# EAGLE design H2 REV1.3 (EAGLE 9.6.2)
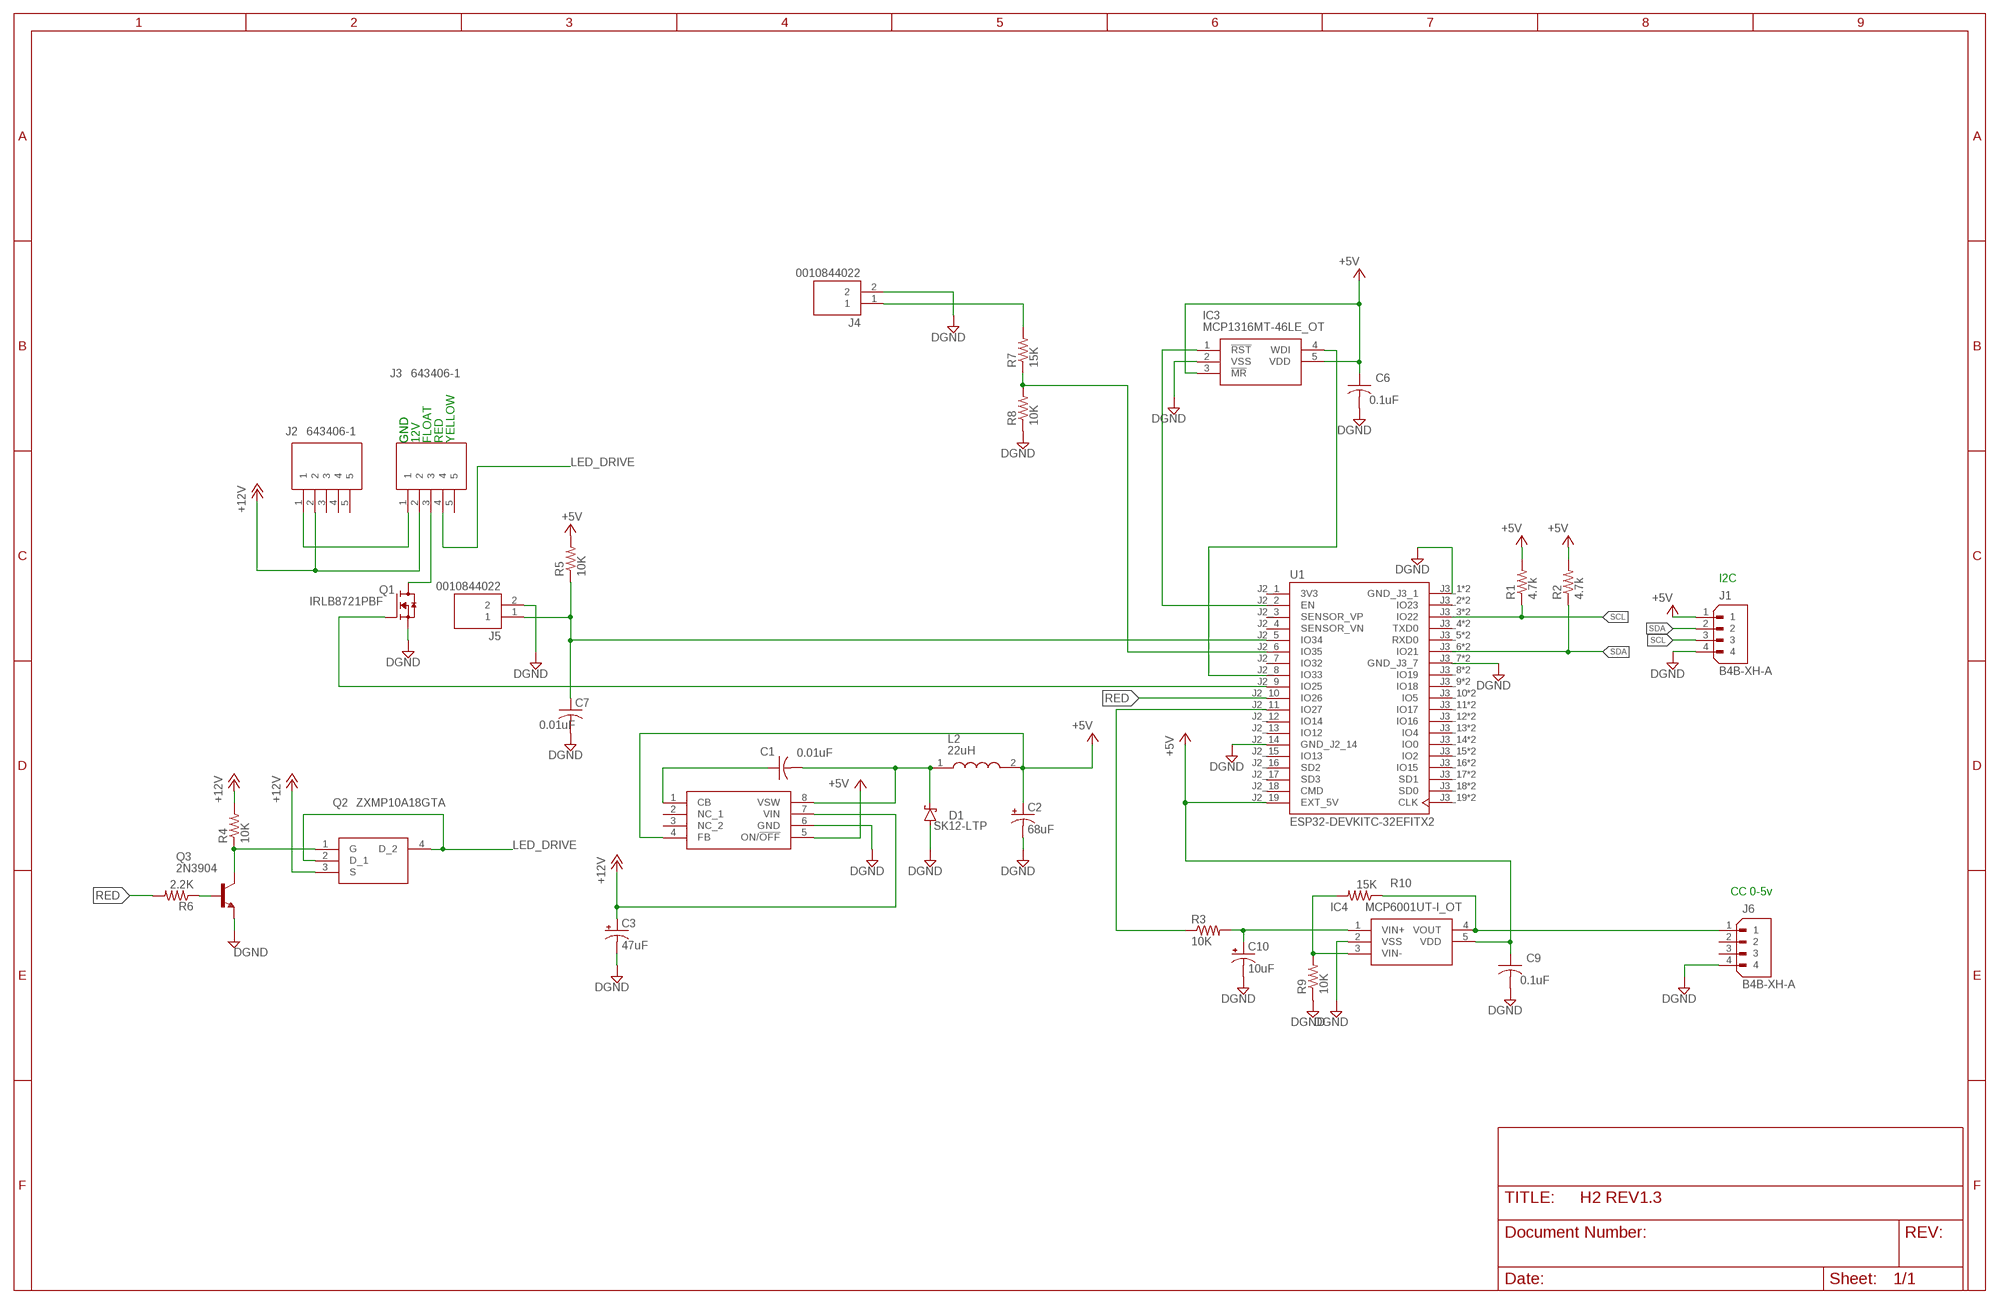
[diagram p0: schematic, sheet 1]

## Parts
C1  0.01uF  C-USC0805  [C0805]
C2  68uF  CPOL-USCT3528  [CT3528]
C3  47uF  CPOL-USCT7343  [CT7343]
C6  0.1uF  C-USC0805  [C0805]
C7  0.01uF  C-USC0805  [C0805]
C9  0.1uF  C-USC0805  [C0805]
C10  10uF  CPOL-USCT7343  [CT7343]
D1  SK12-LTP  SCHOTTKY-DIODESMD  [SMB]
IC2  LM2675M-5.0  LM2675M-ADJ_NOPB  [SOIC127P600X175-8N]
IC3  MCP1316MT-46LE_OT  [SOT95P280X145-5N]
IC4  MCP6001UT-I_OT  [SOT95P280X145-5N]
J1  B4B-XH-A  [JST_B4B-XH-A]
J2  643406-1  [6434061]
J3  643406-1  [6434061]
J4  0010844022  [MOLEX_0010844022]
J5  0010844022  [MOLEX_0010844022]
J6  B4B-XH-A  [JST_B4B-XH-A]
L2  22uH  7447713680  [7447714220]
Q1  IRLB8721PBF  [TO254P1067X483X2057-3]
Q2  ZXMP10A18GTA  [SOT230P700X180-4N]
Q3  2N3904  -NPN-SOT23-EBC  [SOT23-EBC]
R1  4.7k  R-US_R0805  [R0805]
R2  4.7k  R-US_R0805  [R0805]
R3  10K  R-US_R0805  [R0805]
R4  10K  R-US_M0805  [M0805]
R5  10K  R-US_R0805  [R0805]
R6  2.2K  R-US_M0805  [M0805]
R7  15K  R-US_R0805  [R0805]
R8  10K  R-US_R0805  [R0805]
R9  10K  R-US_R0805  [R0805]
R10  15K  R-US_R0805  [R0805]
U1  ESP32-DEVKITC-32EFITX2  [MODULE_ESP32-DEVKITC-32E]

## Nets
+5V: C2.+ C6.1 C9.1 IC2.4(FB) IC2.5(ON/!OFF) IC3.3(!MR) IC3.5(VDD) IC4.5(VDD) J1.1 L2.2 R1.2 R2.2 R5.2 U1.J2_19(EXT_5V)
+12V: C3.+ IC2.7(VIN) J2.2 J3.2 Q2.3(S) R4.2
DGND: C2.- C3.- C6.2 C7.2 C9.2 C10.- D1.A IC2.6(GND) IC3.2(VSS) IC4.2(VSS) J1.4 J4.2 J5.2 J6.4 Q1.3(S) Q3.E R8.1 R9.1 U1.J2_14(GND_J2_14) U1.J3_1(GND_J3_1) U1.J3_7(GND_J3_7) U1.P$1(GND_J3_1) U1.P$7(GND_J3_7)
LED_DRIVE: J3.4 Q2.2(D_1) Q2.4(D_2)
N$1: IC4.4(VOUT) J6.1 R10.1
N$3: Q1.1(G) U1.J2_9(IO25)
N$4: J3.3 Q1.2(D)
N$5: C10.+ IC4.1(VIN+) R3.2
N$6: J4.1 R7.2
N$7: C1.1 IC2.1(CB)
N$8: J2.1 J3.1
N$9: C1.2 D1.C IC2.8(VSW) L2.1
N$11: R7.1 R8.2 U1.J2_6(IO35)
N$12: IC3.1(!RST) U1.J2_2(EN)
N$13: R3.1 U1.J2_11(IO27)
N$14: Q3.B R6.1
N$15: Q2.1(G) Q3.C R4.1
N$16: C7.1 J5.1 R5.1 U1.J2_5(IO34)
N$17: IC3.4(WDI) U1.J2_8(IO33)
N$18: IC4.3(VIN-) R9.2 R10.2
RED: R6.2 U1.J2_10(IO26)
SCL: J1.3 R1.1 U1.J3_3(IO22) U1.P$3(IO22)
SDA: J1.2 R2.1 U1.J3_6(IO21) U1.P$6(IO21)
Unconnected: IC2.2(NC_1) IC2.3(NC_2) J2.3 J2.4 J2.5 J3.5 J6.2 J6.3 U1.J2_3(SENSOR_VP) U1.J2_4(SENSOR_VN) U1.J2_7(IO32) U1.J2_12(IO14) U1.J2_13(IO12) U1.J2_15(IO13) U1.J2_16(SD2) U1.J2_17(SD3) U1.J2_18(CMD) U1.J3_2(IO23) U1.J3_4(TXD0) U1.J3_5(RXD0) U1.J3_8(IO19) U1.J3_9(IO18) U1.J3_10(IO5) U1.J3_11(IO17) U1.J3_12(IO16) U1.J3_13(IO4) U1.J3_14(IO0) U1.J3_15(IO2) U1.J3_16(IO15) U1.J3_17(SD1) U1.J3_18(SD0) U1.J3_19(CLK) U1.P$2(IO23) U1.P$4(TXD0) U1.P$5(RXD0) U1.P$8(IO19) U1.P$9(IO18) U1.P$10(IO5) U1.P$11(IO17) U1.P$12(IO16) U1.P$13(IO4) U1.P$14(IO0) U1.P$15(IO2) U1.P$16(IO15) U1.P$17(SD1) U1.P$18(SD0) U1.P$19(CLK)

## Notes on the sheet
- GND | GND | 12V | FLOAT | RED | YELLOW
- I2C
- CC 0-5v

## Power pins joined to a net without a drawn wire
3V3: U1.J2_1(3V3)

## Library data of the parts
C1 C6 C7 C9 = rcl:C-US: CAPACITOR, American symbol; SPICEPREFIX: C
C2 C3 C10 = rcl:CPOL-US: POLARIZED CAPACITOR, American symbol; SPICEPREFIX: C
D1 = diode:SCHOTTKY-DIODE: Schottky Diode
IC2 = LM2675M-ADJ_NOPB:LM2675M-ADJ_NOPB: SIMPLE SWITCHER 6.5V to 40V, 1A Low Component Count Step-Down Regulator Source: Datasheet <https://datasheet.datasheetarchive.com/originals/distributors/Datasheets-SFU2/DSASFU100036609.pdf>; DESCRIPTION: SIMPLE SWITCHER 6.5V to 40V, 1A Low Component Count Step-Down Regulator; HEIGHT: 1.75mm; MANUFACTURER_NAME: Texas Instruments; MANUFACTURER_PART_NUMBER: LM2675M-ADJ/NOPB; MOUSER_PART_NUMBER: 926-LM2675M-ADJ/NOPB; MOUSER_PRICE-STOCK: https://www.mouser.co.uk/ProductDetail/Texas-Instruments/LM2675M-ADJ-NOPB?qs=X1J7HmVL2ZGqnEBT23BgrQ%3D%3D
IC3 = MCP1316MT-46LE_OT:MCP1316MT-46LE_OT: Low Supply Current: 1 A (Typical),10 A (Max.) Precision Monitoring Trip Point Options: - 2.9V and 4.6V (Standard Offerings) - 2.0V to 4.7V in 100 mV Increments, (Contact the local Microchip Sales Office) Resets Microcontroller in a Power-loss Event Reset Delay Time-Out Option: - 1.4 ms, 30 ms, 200 ms, or 1.6s (Typical) Watchdog Timer Input Time-Out Options: - 6.3 ms, 102 ms, 1.6s, or 25.6s (Typical) Manual Reset (MR) Input (Active-low) Single and Complementary Reset Output(s) R Source: Datasheet <http://www.microchip.com/mymicrochip/filehandler.aspx?ddocname=en025429>; DESCRIPTION: Low Supply Current: 1 A (Typical),10 A (Max.) Precision Monitoring Trip Point Options: - 2.9V and 4.6V (Standard Offerings) - 2.0V to 4.7V in 100 mV Increments, (Contact the local Microchip Sales Office) Resets Microcontroller in a Power-loss Event Reset Delay Time-Out Option: - 1.4 ms, 30 ms, 200 ms, or 1.6s (Typical) Watchdog Timer Input Time-Out Options: - 6.3 ms, 102 ms, 1.6s, or 25.6s (Typical) Manual Reset (MR) Input (Active-low) Single and Complementary Reset Output(s) R; HEIGHT: 1.45mm; MANUFACTURER_NAME: Microchip; MANUFACTURER_PART_NUMBER: MCP1316MT-46LE/OT; MOUSER_PART_NUMBER: 579-MCP1316MT46LE/OT; MOUSER_PRICE-STOCK: https://www.mouser.co.uk/ProductDetail/Microchip-Technology/MCP1316MT-46LE-OT/?qs=usxtMOJb1RwRwhJF9sjOIg%3D%3D
IC4 = MCP6001UT-I_OT:MCP6001UT-I_OT: 1 MHz, Low-Power Op Amp Source: Datasheet <http://componentsearchengine.com/Datasheets/3/MCP6001UT-I_OT.pdf>; DESCRIPTION: 1 MHz, Low-Power Op Amp; HEIGHT: 1.45mm; MANUFACTURER_NAME: Microchip; MANUFACTURER_PART_NUMBER: MCP6001UT-I/OT; MOUSER_PART_NUMBER: 579-MCP6001UT-I/OT; MOUSER_PRICE-STOCK: https://www.mouser.co.uk/ProductDetail/Microchip-Technology/MCP6001UT-I-OT?qs=Sez7gRs8XSU2iw24kVuIOw%3D%3D
J1 J6 = B4B-XH-A:B4B-XH-A: Check availability <https://pricing.snapeda.com/parts/B4B-XH-A/JST%20Sales/view-part?ref=eda>; AVAILABILITY: In Stock; CHECK_PRICES: https://www.snapeda.com/parts/B4B-XH-A/JST/view-part/?ref=eda; DESCRIPTION: Connector Header Through Hole 4 position 0.098 (2.50mm); MF: JST Sales; MP: B4B-XH-A; PACKAGE: None; PRICE: None; SNAPEDA_LINK: https://www.snapeda.com/parts/B4B-XH-A/JST/view-part/?ref=snap
J2 J3 = 643406-1:643406-1: Configuration Features: Number of Positions 5 | Number of Rows 1 | PCB Mount Orientation Vertical | Number of Power Positions 5 | Contact Features: Contact Mating Area Plating Material Thickness 3.81 5.08 MICM | Contact Layout Inline | Contact Retention Within Housing Without | Contact Mating Area Plating Material Thickness 150 200 MICIN | Contact Current Rating (Max) 12 AMP | Contact Type Pin | Contact Mating Area Plating Material Tin | PCB Contact Termination Area Plating Material Pre-Tin | Multip Source: Datasheet <https://www.te.com/commerce/DocumentDelivery/DDEController?Action=srchrtrv&DocNm=82181_SOFTSHELL_STANDARD_DENSITY&DocType=Catalog Section&DocLang=English&PartCntxt=643406-1&DocFormat=pdf>; DESCRIPTION: Configuration Features: Number of Positions 5 | Number of Rows 1 | PCB Mount Orientation Vertical | Number of Power Positions 5 | Contact Features: Contact Mating Area Plating Material Thickness 3.81 5.08 MICM | Contact Layout Inline | Contact Retention Within Housing Without | Contact Mating Area Plating Material Thickness 150 200 MICIN | Contact Current Rating (Max) 12 AMP | Contact Type Pin | Contact Mating Area Plating Material Tin | PCB Contact Termination Area Plating Material Pre-Tin | Multip; HEIGHT: 14.86mm; MANUFACTURER_NAME: TE Connectivity; MANUFACTURER_PART_NUMBER: 643406-1; MOUSER_PART_NUMBER: 571-6434061; MOUSER_PRICE-STOCK: https://www.mouser.co.uk/ProductDetail/TE-Connectivity-AMP/643406-1?qs=WZe4RBw4ZxdOz8s%252B2HqyCA%3D%3D
J4 J5 = 0010844022:0010844022; MANUFACTURER: Molex; MAXIMUM_PACKAGE_HEIGHT: 13.97mm; PARTREV: D6; STANDARD: Manufacturer Recommendations
L2 = 7447713680:7447713680: SMD-Shielded Power Inductors WE-PD Source: Datasheet <https://componentsearchengine.com/Datasheets/1/7447713680.pdf>; DESCRIPTION: SMD-Shielded Power Inductors WE-PD; HEIGHT: 5mm; MANUFACTURER_NAME: Wurth Elektronik; MANUFACTURER_PART_NUMBER: 7447713680; MOUSER_PART_NUMBER: 710-7447713680; MOUSER_PRICE-STOCK: https://www.mouser.com/Search/Refine.aspx?Keyword=710-7447713680
Q1 = IRLB8721PBF:IRLB8721PBF: Check availability <https://pricing.snapeda.com/parts/IRLB8721PBF/Infineon%20Technologies/view-part?ref=eda>; AVAILABILITY: In Stock; CHECK_PRICES: https://www.snapeda.com/parts/IRLB8721PBF/Infineon/view-part/?ref=eda; DESCRIPTION: IRLB8721PBF N-channel MOSFET Transistor, 62 A, 30 V, 3-Pin TO-220AB | Infineon IRLB8721PBF; MF: Infineon Technologies; MP: IRLB8721PBF; PACKAGE: TO-220-3 Infineon; PRICE: None; SNAPEDA_LINK: https://www.snapeda.com/parts/IRLB8721PBF/Infineon/view-part/?ref=snap
Q2 = ZXMP10A18GTA:ZXMP10A18GTA: MOSFET P-Channel 100V 3.7A SOT223 Diodes Inc ZXMP10A18GTA P-channel MOSFET Transistor, 3.7 A, 100 V, 3+Tab-Pin SOT-223 Source: Datasheet <https://www.diodes.com//assets/Datasheets/ZXMP10A18G.pdf>; DESCRIPTION: MOSFET P-Channel 100V 3.7A SOT223 Diodes Inc ZXMP10A18GTA P-channel MOSFET Transistor, 3.7 A, 100 V, 3+Tab-Pin SOT-223; HEIGHT: 1.8mm; MANUFACTURER_NAME: Diodes Incorporated; MANUFACTURER_PART_NUMBER: ZXMP10A18GTA; MOUSER_PART_NUMBER: 522-ZXMP10A18GTA; MOUSER_PRICE-STOCK: https://www.mouser.co.uk/ProductDetail/Diodes-Incorporated/ZXMP10A18GTA?qs=4zh0VFflF2HAv%2FEizliMow%3D%3D
Q3 = transistor:*-NPN-: NPN Transistror BF959 corrected 2008.03.06
R1-R10 = rcl:R-US_: RESISTOR, American symbol; SPICEPREFIX: R
U1 = ESP32-DEVKITC-32E:ESP32-DEVKITC-32E: Check availability <https://pricing.snapeda.com/parts/ESP32-DEVKITC-32E/Espressif%20Systems/view-part?ref=eda>

## Board
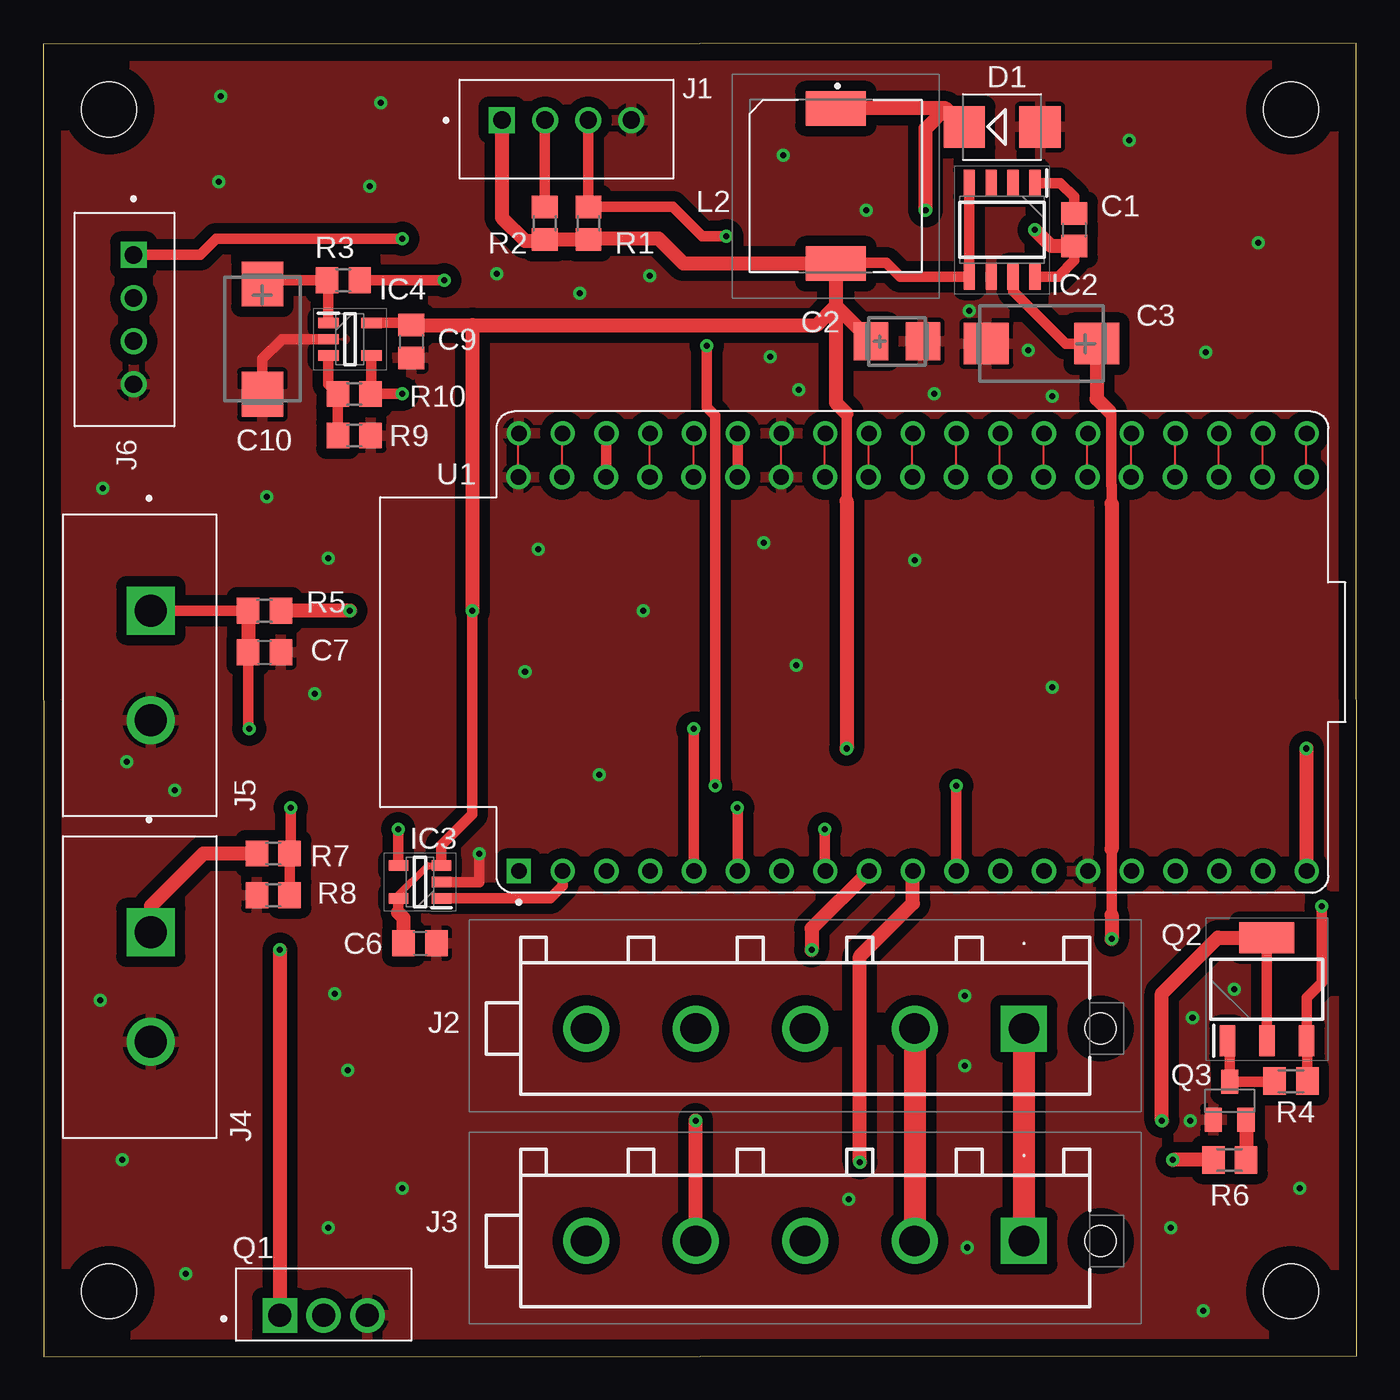
[diagram p1: board, top side]
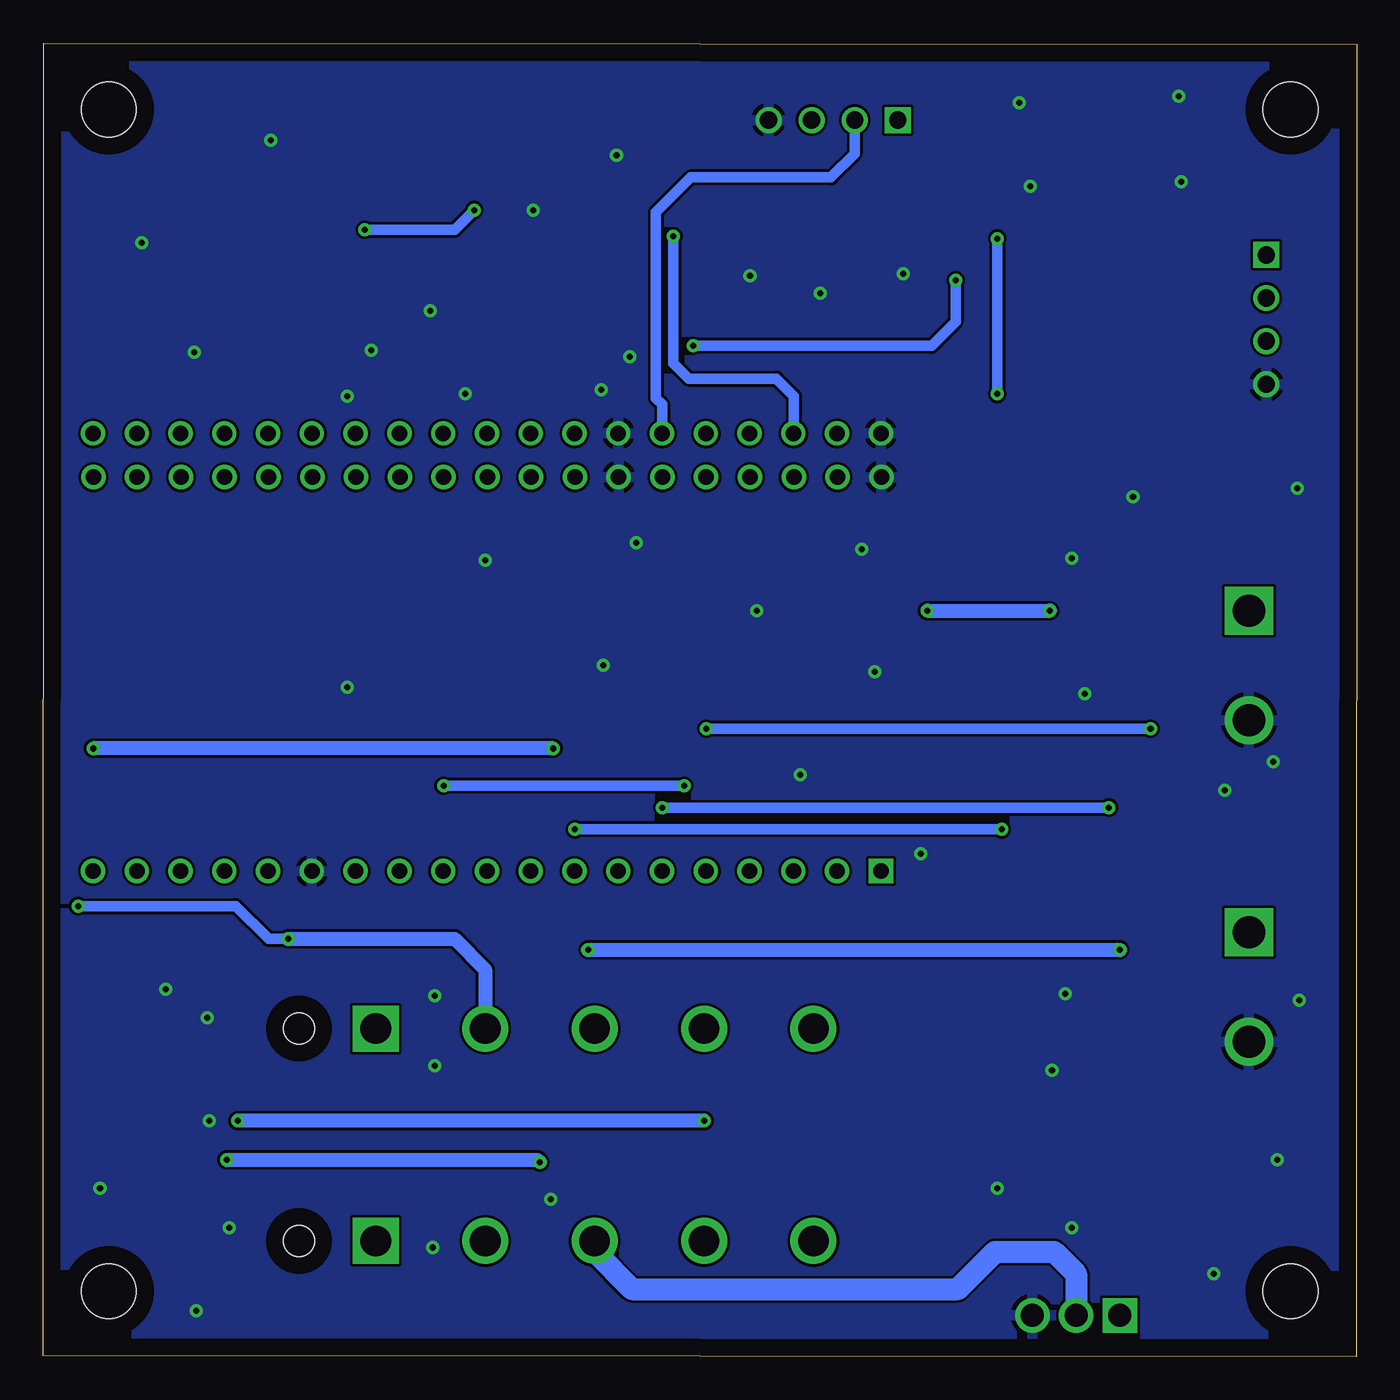
[diagram p2: board, bottom side, seen from below]

Size 76.23 x 76.24 mm. Coordinates in mm from the lower left corner, seen from the top.
Outline: 0.03,0 76.23,0.08 76.2,76.24 0,76.17 0.03,0
Copper layers (1*16): Top 0.035mm / dielectric 1.5mm / Bottom 0.035mm
Design rules "default": minimum track width 6mil, minimum drill 0.35mm, track to track 6mil, track to pad 6mil, pad to pad 6mil, via to via 6mil, smd to smd 6mil, copper to edge 40mil, drill to drill 6mil, minimum pad ring 10mil, minimum via ring 8mil, stop-mask expansion 4mil, vias tented up to drill 0mil, thermal gap 10mil
Holes 3.17 mm at 3.84,3.81 72.42,3.81 72.42,72.39 3.84,72.39

### Footprints (pad centres in the part's own frame; a part is rotated, then mirrored left to right if it is on the bottom)
C0805 = smd 1.3 x 1.5: 1 -0.95,0; 2 0.95,0
CT3528 = smd 2 x 2.2: + -1.5,0; - 1.5,0
CT7343 = smd 2.6 x 2.4: + -3.2,0; - 3.2,0
SMB = smd 2.4 x 2.4: A 2.2,0; C -2.2,0
SOIC127P600X175-8N = smd 1.528 x 0.65: 1 -2.711,1.905; 2 -2.711,0.635; 3 -2.711,-0.635; 4 -2.711,-1.905; 5 2.711,-1.905; 6 2.711,-0.635; 7 2.711,0.635; 8 2.711,1.905
SOT95P280X145-5N = smd 1.15 x 0.6: 1 -1.25,0.95; 2 -1.25,0; 3 -1.25,-0.95; 4 1.25,-0.95; 5 1.25,0.95
SOT95P280X145-5N' = smd 1.2 x 0.6: 1 -1.25,0.95; 2 -1.25,0; 3 -1.25,-0.95; 4 1.25,-0.95; 5 1.25,0.95
JST_B4B-XH-A = drill 1 square: 1 3.75,-0.525 | drill 1: 2 1.25,-0.525; 3 -1.25,-0.525; 4 -3.75,-0.525
6434061 = drill 1.78 pad 2.67 square: 1 0,0 | drill 1.78 pad 2.67: 2 6.35,0; 3 12.7,0; 4 19.05,0; 5 25.4,0 | hole 1.78: -4.45,0
MOLEX_0010844022 = drill 1.86 square: 1 -3.175,0 | drill 1.86: 2 3.175,0
7447714220 = smd 2 x 3.5: 1 -4.5,0; 2 4.5,0
TO254P1067X483X2057-3 = drill 1.33 pad 2 square: 1 -2.54,0 | drill 1.33 pad 2: 2 0,0; 3 2.54,0
SOT230P700X180-4N = smd 1.8 x 0.9: 1 -3,2.3; 2 -3,0; 3 -3,-2.3 | smd 1.8 x 3.2: 4 3,0
SOT23-EBC = smd 1 x 1.4: B 0.95,-1.1; C 0,1.1; E -0.95,-1.1
R0805 = smd 1.3 x 1.5: 1 -0.95,0; 2 0.95,0
M0805 = smd 1.3 x 1.6: 1 -0.95,0; 2 0.95,0
MODULE_ESP32-DEVKITC-32E = drill 0.9 square: J2_1 -12.7,22.835 | drill 0.9: J2_2 -12.7,20.295; J2_3 -12.7,17.755; J2_4 -12.7,15.215; J2_5 -12.7,12.675; J2_6 -12.7,10.135; J2_7 -12.7,7.595; J2_8 -12.7,5.055; J2_9 -12.7,2.515; J2_10 -12.7,-0.025; J2_11 -12.7,-2.565; J2_12 -12.7,-5.105; J2_13 -12.7,-7.645; J2_14 -12.7,-10.185; J2_15 -12.7,-12.725; J2_16 -12.7,-15.265; J2_17 -12.7,-17.805; J2_18 -12.7,-20.345; J2_19 -12.7,-22.885; J3_1 12.7,22.835; J3_2 12.7,20.295; J3_3 12.7,17.755; J3_4 12.7,15.215; J3_5 12.7,12.675; J3_6 12.7,10.135; J3_7 12.7,7.595; J3_8 12.7,5.055; J3_9 12.7,2.515; J3_10 12.7,-0.025; J3_11 12.7,-2.565; J3_12 12.7,-5.105; J3_13 12.7,-7.645; J3_14 12.7,-10.185; J3_15 12.7,-12.725; J3_16 12.7,-15.265; J3_17 12.7,-17.805; J3_18 12.7,-20.345; J3_19 12.7,-22.885 | drill 0.9 pad 1.422: P$1 10.16,22.86; P$2 10.16,20.32; P$3 10.16,17.78; P$4 10.16,15.24; P$5 10.16,12.7; P$6 10.16,10.16; P$7 10.16,7.62; P$8 10.16,5.08; P$9 10.16,2.54; P$10 10.16,0; P$11 10.16,-2.54; P$12 10.16,-5.08; P$13 10.16,-7.62; P$14 10.16,-10.16; P$15 10.16,-12.7; P$16 10.16,-15.24; P$17 10.16,-17.78; P$18 10.16,-20.32; P$19 10.16,-22.86

### Placement (x,y rotation side)
C1  59.84,65.41 270 top
C2  49.56,58.93 0 top
C3  57.94,58.8 180 top
C6  21.87,24 0 top
C7  12.85,40.89 0 top
C9  21.36,58.93 270 top
C10  12.73,59.05 270 top
D1  55.65,71.37 0 top
IC2  55.65,65.41 270 top
IC3  21.87,27.56 180 top
IC4  MCP6001UT-I_OT  [SOT95P280X145-5N']  17.81,59.05 0 top
J1  30.38,71.25 180 top
J2  56.92,19.05 180 top
J3  56.92,6.73 180 top
J4  6.25,21.46 270 top
J5  6.25,40.13 270 top
J6  4.72,60.2 90 top
L2  46,67.94 270 top
Q1  16.28,2.41 0 top
Q2  71.02,21.34 90 top
Q3  68.86,14.86 0 top
R1  31.65,65.79 270 top
R2  29.11,65.79 270 top
R3  17.42,62.48 180 top
R4  72.42,16 0 top
R5  12.85,43.31 0 top
R6  68.86,11.43 180 top
R7  13.36,29.21 180 top
R8  13.36,26.8 0 top
R9  18.06,53.47 180 top
R10  18.06,55.88 180 top
U1  50.44,40.89 90 top

### Tracks (layer width: path | path; a pad name or v marks a point on that pad's centre or on a via)
+5V  (via drill 0.35)
  Top 0.406: IC3.5 20.62,26.82 22.31,28.51 IC3.3
  Top 0.61: L2.2 46.05,63.5 48.92,63.5 49.73,62.69 IC2.5 IC2.4 | 46.63,54.74 46.63,49.66 | IC4.5 21.23,60.01 C9.1 | v24.92,43.31 24.92,31.5 23.12,29.7 IC3.3 | 20.6,25.78 20.6,26.59 IC3.5
  Top 0.813: 46,60.98 L2.2 37.16,63.45 35.71,64.9 31.71,64.9 R1.2 R2.2 29.04,64.77 27.97,64.77 26.63,66.11 J1.1 | C2.+ 46,60.98 | 46,60.98 46,55.37 46.63,54.74 | 46.63,49.66 v46.63,35.31 | v73.3,35.31 73.3,28.22 U1.J2_19 | C9.1 24.92,59.88 | 24.92,59.88 44.89,59.88 46,60.98 | 24.92,59.88 v24.92,43.31 | v17.81,43.31 R5.2 | C6.1 20.92,25.46 20.6,25.78
  Bottom 0.813: v46.63,35.31 v73.3,35.31 | v24.92,43.31 v17.81,43.31
+12V  (via drill 0.35)
  Top 0.61: IC2.7 56.29,61.85 59.33,58.8 C3.+ | 62,49.53 62,50.55 61.98,50.57 61.98,54.76 61.87,54.86 | 62,29.46 62,25.65 | v74.19,26.16 74.19,21.72 73.32,20.84 Q2.3 73.37,18.29 R4.2
  Top 0.813: C3.+ 61.14,55.6 61.87,54.86 | 62,49.53 62,29.46 | 62,25.65 v62,24.26
  Top 1.27: J2.2 J3.2
  Bottom 0.61: v74.19,26.16 65.05,26.16 63.14,24.26 v62,24.26
  Bottom 0.813: v62,24.26 52.35,24.26 50.57,22.48 J2.2
DGND  (via drill 0.35)
  Top 0.61: C10.- 12.73,57.91 13.87,59.05 IC4.2 | IC3.2 25.3,27.56 v25.3,29.21
  other vias: 53.49,16.89 66.7,19.68 69.11,21.34 66.57,13.72 65.43,7.49 72.92,9.78 67.34,2.67 53.49,20.95 53.62,6.35 46.76,9.14 16.92,21.08 20.85,9.78 16.54,7.49 17.68,16.64 28.73,46.86 32.28,33.78 34.82,43.31 41.81,47.24 43.71,40.13 50.57,46.23 58.57,38.86 63.02,70.61 70.51,64.64 67.46,58.29 42.95,69.72 47.78,66.55 53.75,60.71 57.18,58.42 51.71,55.88 58.57,55.75 42.19,58.04 43.84,56.13 26.31,62.87 31.14,61.72 35.2,62.74 10.31,73.15 18.95,67.94 19.58,72.77 12.98,49.91 16.54,46.35 3.45,50.42 10.19,68.2 15.77,38.48 7.65,32.89 4.85,34.54 4.6,11.43 8.28,4.83 3.33,20.7 27.97,39.75
  pour Bottom: 0.03,0 0.03,76.2 76.1,76.2 76.1,0
  pour Top (isolate 0.61): 0.03,0 0.03,76.2 76.23,76.2 76.23,0
LED_DRIVE  (via drill 0.35)
  Top 0.61: Q2.2 Q2.4
  Top 0.813: J3.4 v37.87,13.72 | Q2.4 68.18,24.34 64.92,21.08 v64.92,13.72
  Bottom 0.813: v37.87,13.72 v64.92,13.72
N$1  (via drill 0.35)
  Top 0.61: IC4.4 19.06,55.93 | 19.06,55.93 R10.1 | J6.1 9.11,63.95 10.06,64.9 v20.85,64.9 | v20.85,55.88 19.1,55.88 19.06,55.93
  Bottom 0.61: v20.85,64.9 v20.85,55.88
N$3  (via drill 0.35)
  Top 0.813: U1.J2_9 44.6,24.87 v44.6,23.62 | v13.74,23.62 Q1.1
  Bottom 0.813: v44.6,23.62 v13.74,23.62
N$4
  Bottom 1.27: J3.3 44.22,6.1 42.06,3.94 23.14,3.94 20.98,6.1 17.55,6.1 16.28,4.83 Q1.2
N$5
  Top 0.61: IC4.1 16.56,62.4 R3.2 12.95,62.48 C10.+
N$6
  Top 0.813: R7.2 9.3,29.21 6.25,26.16 J4.1
N$7
  Top 0.61: C1.1 59.84,67.31 59.04,68.12 IC2.1
N$8
  Top 1.27: J2.1 J3.1
N$9  (via drill 0.35)
  Top 0.61: C1.2 59.84,63.63 58.91,62.69 IC2.8
  Top 0.813: D1.C 52.38,72.44 | 52.38,72.44 L2.1 | C1.2 58.51,64.45 v57.56,65.41 | v51.21,66.55 51.21,67.06 51.21,71.27 52.38,72.44
  Bottom 0.61: v57.56,65.41 52.35,65.41 v51.21,66.55
N$11  (via drill 0.35)
  Top 0.61: R8.2 R7.1 14.38,29.28 v14.38,31.88 | U1.J2_6 40.31,31.85 v40.28,31.88
  Bottom 0.61: v40.28,31.88 v14.38,31.88
N$12
  Top 0.61: IC3.1 29.43,26.61 30.15,27.33 U1.J2_2
N$13  (via drill 0.35)
  Top 0.61: R3.1 v23.27,62.48 | v38.51,58.67 38.51,55.12 39.01,54.61 v39.01,33.15 | v52.98,33.15 52.98,28.22 U1.J2_11
  Bottom 0.61: v23.27,62.48 23.27,60.07 24.66,58.67 v38.51,58.67 | v39.01,33.15 v52.98,33.15
N$14
  Top 0.813: Q3.B R6.1
N$15
  Top 0.61: Q2.1 68.86,18.2 Q3.C 71.42,15.96 R4.1
N$16  (via drill 0.35)
  Top 0.61: J5.1 R5.1 | C7.1 11.9,36.45 v11.96,36.45 | v37.74,36.45 37.74,28.19 U1.J2_5
  Top 0.813: R5.1 C7.1
  Bottom 0.61: v11.96,36.45 v37.74,36.45
N$17  (via drill 0.35)
  Top 0.61: IC3.4 20.62,30.59 v20.6,30.61 | v45.36,30.61 45.36,28.22 U1.J2_8
  Bottom 0.61: v20.6,30.61 v45.36,30.61
N$18
  Top 0.61: IC4.3 16.56,56.43 R10.2 R9.2
RED  (via drill 0.35)
  Top 0.813: R6.2 v65.56,11.43 | v47.4,11.3 47.4,23.24 50.47,26.31 U1.J2_10
  Bottom 0.813: v65.56,11.43 47.52,11.43 v47.4,11.3
SCL  (via drill 0.35)
  Top 0.61: J1.3 31.63,66.76 R1.1 36.54,66.74 38.25,65.02 v39.65,65.02 | U1.J3_3 32.69,51.05 U1.P$3
  Bottom 0.61: v39.65,65.02 39.65,57.66 38.76,56.77 33.68,56.77 32.66,55.75 32.66,53.62 U1.J3_3
SDA
  Top 0.61: J1.2 29.11,71.75 R2.1 | U1.J3_6 40.31,51.05 U1.P$6
  Bottom 0.61: J1.2 29.13,69.83 30.51,68.45 38.63,68.45 40.67,66.42 40.67,55.63 40.31,55.27 U1.J3_6